# EAGLE design schematic (EAGLE 9.2.2)
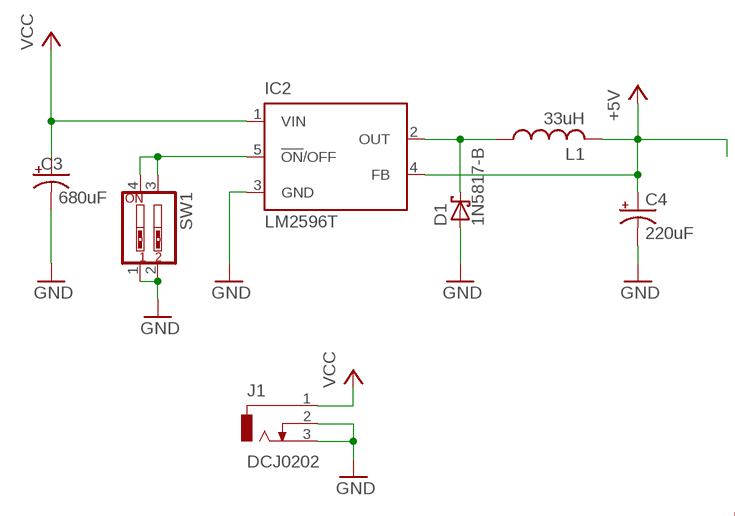
[diagram p0: schematic, sheet 1, part 1 of 2]
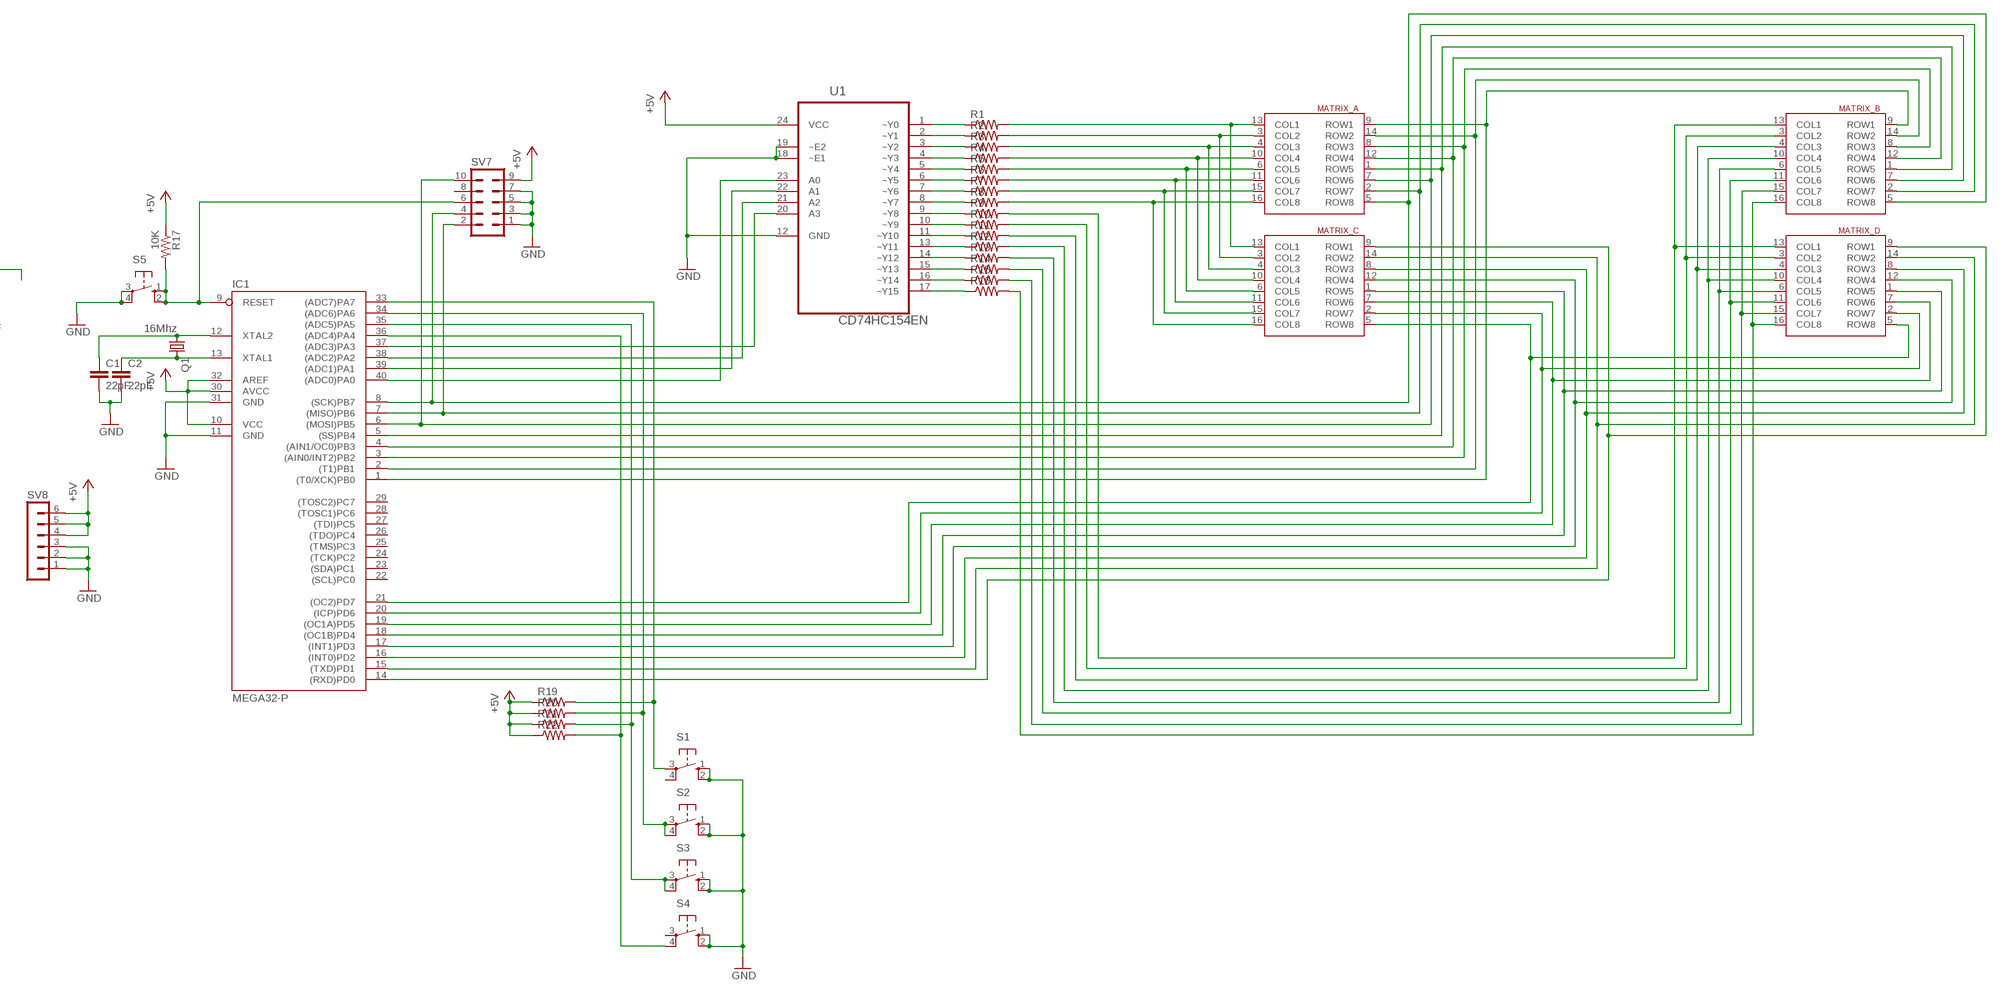
[diagram p1: schematic, sheet 1, part 2 of 2]

## Parts
C1  22pF  C-EU025-024X044  [C025-024X044]
C2  22pF  C-EU025-024X044  [C025-024X044]
C3  680uF  CPOL-USE3.5-8  [E3,5-8]
C4  220uF  CPOL-USE3.5-8  [E3,5-8]
D1  1N5817-B  [DO41-7.6]
IC1  MEGA32-P  [DIL40]
IC2  LM2596T  [T05D]
J1  DCJ0202  [DCJ0202]
L1  33uH  L-US0207/10  [0207/10]
MATRIX_A  LED_8X8_MATRIXYGD2/A  [MATRIX_8X8_38MM]
MATRIX_B  LED_8X8_MATRIXYGD2/A  [MATRIX_8X8_38MM]
MATRIX_C  LED_8X8_MATRIXYGD2/A  [MATRIX_8X8_38MM]
MATRIX_D  LED_8X8_MATRIXYGD2/A  [MATRIX_8X8_38MM]
Q1  16Mhz  CRYSTALHC49S  [HC49/S]
R1  R-US_0204/2V  [0204V]
R2  R-US_0204/2V  [0204V]
R3  R-US_0204/2V  [0204V]
R4  R-US_0204/2V  [0204V]
R5  R-US_0204/2V  [0204V]
R6  R-US_0204/2V  [0204V]
R7  R-US_0204/2V  [0204V]
R8  R-US_0204/2V  [0204V]
R9  R-US_0204/2V  [0204V]
R10  R-US_0204/2V  [0204V]
R11  R-US_0204/2V  [0204V]
R12  R-US_0204/2V  [0204V]
R13  R-US_0204/2V  [0204V]
R14  R-US_0204/2V  [0204V]
R15  R-US_0204/2V  [0204V]
R16  R-US_0204/2V  [0204V]
R17  10K  R-US_0204/7  [0204/7]
R19  R-US_0204/7  [0204/7]
R20  R-US_0204/7  [0204/7]
R21  R-US_0204/7  [0204/7]
R22  R-US_0204/7  [0204/7]
S1  10-XX  [B3F-10XX]
S2  10-XX  [B3F-10XX]
S3  10-XX  [B3F-10XX]
S4  10-XX  [B3F-10XX]
S5  10-XX  [B3F-10XX]
SV7  MA05-2  [MA05-2]
SV8  MA06-1  [MA06-1]
SW1  SW_DIP-2  [EDG-02]
U1  CD74HC154EN  [DIP254P762X508-24]

## Nets
+5V: C4.+ IC1.10(VCC) IC1.30(AVCC) IC1.32(AREF) IC2.4(FB) L1.2 R17.1 R19.1 R20.1 R21.1 R22.1 SV7.9 SV8.4 SV8.5 SV8.6 U1.24(VCC)
GND: C1.2 C2.2 C3.- C4.- D1.A IC1.11(GND) IC1.31(GND) IC2.3(GND) J1.2 J1.3 S1.1(S) S1.2(S1) S2.1(S) S2.2(S1) S3.1(S) S3.2(S1) S4.1(S) S4.2(S1) S5.3(P) S5.4(P1) SV7.1 SV7.3 SV7.5 SV7.7 SV8.1 SV8.2 SV8.3 SW1.1 SW1.2 U1.12(GND) U1.18(~E1) U1.19(~E2)
N$1: R1.1 U1.1(~Y0)
N$2: R2.1 U1.2(~Y1)
N$3: R3.1 U1.3(~Y2)
N$4: R4.1 U1.4(~Y3)
N$5: R5.1 U1.5(~Y4)
N$6: R6.1 U1.6(~Y5)
N$7: R7.1 U1.7(~Y6)
N$8: R8.1 U1.8(~Y7)
N$9: R9.1 U1.9(~Y8)
N$10: R10.1 U1.10(~Y9)
N$11: R11.1 U1.11(~Y10)
N$12: R12.1 U1.13(~Y11)
N$13: R13.1 U1.14(~Y12)
N$14: R14.1 U1.15(~Y13)
N$15: R15.1 U1.16(~Y14)
N$16: R16.1 U1.17(~Y15)
N$17: MATRIX_A.13(COL1) MATRIX_C.13(COL1) R1.2
N$18: MATRIX_A.3(COL2) MATRIX_C.3(COL2) R2.2
N$19: MATRIX_A.4(COL3) MATRIX_C.4(COL3) R3.2
N$20: MATRIX_A.10(COL4) MATRIX_C.10(COL4) R4.2
N$21: MATRIX_A.6(COL5) MATRIX_C.6(COL5) R5.2
N$22: MATRIX_A.11(COL6) MATRIX_C.11(COL6) R6.2
N$23: MATRIX_A.15(COL7) MATRIX_C.15(COL7) R7.2
N$24: MATRIX_A.16(COL8) MATRIX_C.16(COL8) R8.2
N$26: IC1.7((MISO)PB6) MATRIX_A.2(ROW7) MATRIX_B.2(ROW7) SV7.2
N$27: IC1.8((SCK)PB7) MATRIX_A.5(ROW8) MATRIX_B.5(ROW8) SV7.4
N$28: IC1.5((SS)PB4) MATRIX_A.1(ROW5) MATRIX_B.1(ROW5)
N$30: IC1.3((AIN0/INT2)PB2) MATRIX_A.8(ROW3) MATRIX_B.8(ROW3)
N$32: IC1.1((T0/XCK)PB0) MATRIX_A.9(ROW1) MATRIX_B.9(ROW1)
N$34: IC1.15((TXD)PD1) MATRIX_C.14(ROW2) MATRIX_D.14(ROW2)
N$36: IC1.17((INT1)PD3) MATRIX_C.12(ROW4) MATRIX_D.12(ROW4)
N$39: IC1.20((ICP)PD6) MATRIX_C.2(ROW7) MATRIX_D.2(ROW7)
N$41: IC1.9(RESET) R17.2 S5.1(S) S5.2(S1) SV7.6
N$42: MATRIX_B.15(COL7) MATRIX_D.15(COL7) R15.2
N$43: C2.1 IC1.13(XTAL1) Q1.2
N$44: MATRIX_B.6(COL5) MATRIX_D.6(COL5) R13.2
N$45: C1.1 IC1.12(XTAL2) Q1.1
N$46: MATRIX_B.4(COL3) MATRIX_D.4(COL3) R11.2
N$48: MATRIX_B.13(COL1) MATRIX_D.13(COL1) R9.2
N$52: IC1.39((ADC1)PA1) U1.22(A1)
N$54: IC1.37((ADC3)PA3) U1.20(A3)
N$55: IC1.34((ADC6)PA6) R20.2 S2.3(P) S2.4(P1)
N$57: IC1.36((ADC4)PA4) R22.2 S4.4(P1)
N$58: MATRIX_B.3(COL2) MATRIX_D.3(COL2) R10.2
N$59: IC1.2((T1)PB1) MATRIX_A.14(ROW2) MATRIX_B.14(ROW2)
N$60: MATRIX_B.10(COL4) MATRIX_D.10(COL4) R12.2
N$62: MATRIX_B.11(COL6) MATRIX_D.11(COL6) R14.2
N$63: IC1.4((AIN1/OC0)PB3) MATRIX_A.12(ROW4) MATRIX_B.12(ROW4)
N$64: MATRIX_B.16(COL8) MATRIX_D.16(COL8) R16.2
N$66: IC1.6((MOSI)PB5) MATRIX_A.7(ROW6) MATRIX_B.7(ROW6) SV7.10
N$69: IC1.14((RXD)PD0) MATRIX_C.9(ROW1) MATRIX_D.9(ROW1)
N$71: IC1.16((INT0)PD2) MATRIX_C.8(ROW3) MATRIX_D.8(ROW3)
N$73: IC1.18((OC1B)PD4) MATRIX_C.1(ROW5) MATRIX_D.1(ROW5)
N$74: IC1.19((OC1A)PD5) MATRIX_C.7(ROW6) MATRIX_D.7(ROW6)
N$76: IC1.21((OC2)PD7) MATRIX_C.5(ROW8) MATRIX_D.5(ROW8)
N$78: IC1.35((ADC5)PA5) R21.2 S3.3(P) S3.4(P1)
N$80: IC1.33((ADC7)PA7) R19.2 S1.3(P)
N$85: IC1.40((ADC0)PA0) U1.23(A0)
N$87: IC1.38((ADC2)PA2) U1.21(A2)
N$93: D1.C IC2.2(OUT) L1.1
N$94: IC2.5(!ON!/OFF) SW1.3 SW1.4
VCC: C3.+ IC2.1(VIN) J1.1
Unconnected: IC1.22((SCL)PC0) IC1.23((SDA)PC1) IC1.24((TCK)PC2) IC1.25((TMS)PC3) IC1.26((TDO)PC4) IC1.27((TDI)PC5) IC1.28((TOSC1)PC6) IC1.29((TOSC2)PC7) S1.4(P1) S4.3(P) SV7.8

## Library data of the parts
C1 C2 = rcl:C-EU: CAPACITOR, European symbol; SPICEPREFIX: C
C3 C4 = rcl:CPOL-US: POLARIZED CAPACITOR, American symbol; SPICEPREFIX: C
D1 = diode:1N581*: 1.0A SCHOTTKY BARRIER RECTIFIER Source: http://www.diodes.com/datasheets/ds23001.pdf
IC1 = atmel:MEGA32-P: MICROCONTROLLER 32 Kbytes FLASH 2 Kbytes SRAM 1 Kbytes EEPROM USART 8-channel 10 bit ADC Source: www.atmel.com .. doc2503.pdf; MPN: ATMEGA32-16PU; OC_FARNELL: 1661729; OC_NEWARK: 51P1794
IC2 = national-semiconductor:LM2596: SIMPLE SWITCHER® Power Converter 150 kHz 3A Step-Down Voltage Regulator Source: http://www.national.com/ds/LM/LM2596.pdf; MPN: LM2596T-ADJ/LF02; OC_FARNELL: 9494162; OC_NEWARK: 65K5910
J1 = con-jack:DCJ0202: DC POWER JACK Source: DCJ0202.pdf; OC_FARNELL: unknown; OC_NEWARK: unknown
L1 = rcl:L-US: INDUCTOR, American symbol; SPICEPREFIX: L
MATRIX_A MATRIX_B MATRIX_C MATRIX_D = LED:LED_8X8_MATRIX: CPD-15088A YGD2/A Green 8x8 LED matrix
Q1 = crystal:CRYSTAL: CRYSTAL; OC_FARNELL: 1667008; OC_NEWARK: unknown
R1-R16 R19-R22 = rcl:R-US_: RESISTOR, American symbol; SPICEPREFIX: R
R17 = resistor:R-US_: RESISTOR, American symbol
S1-S5 = switch-omron:10-XX: OMRON SWITCH; MPN: B3F-1000; OC_FARNELL: 176432; OC_NEWARK: 36M3542
SV7 = con-lstb:MA05-2: PIN HEADER; OC_FARNELL: unknown; OC_NEWARK: unknown
SV8 = con-lstb:MA06-1: PIN HEADER; OC_FARNELL: unknown; OC_NEWARK: unknown
SW1 = special:SW_DIP-2: DIP SWITCH
U1 = Texas Instruments_By_element14_Batch_1:CD74HC154EN: High-Speed CMOS Logic 4- to 16-Line Decoder/Demultiplexer; MPN: CD74HC154EN; OC_FARNELL: 1287419; OC_NEWARK: 60K5157; PACKAGE: PDIP-24; SUPPLIER: Texas Instruments

## Board
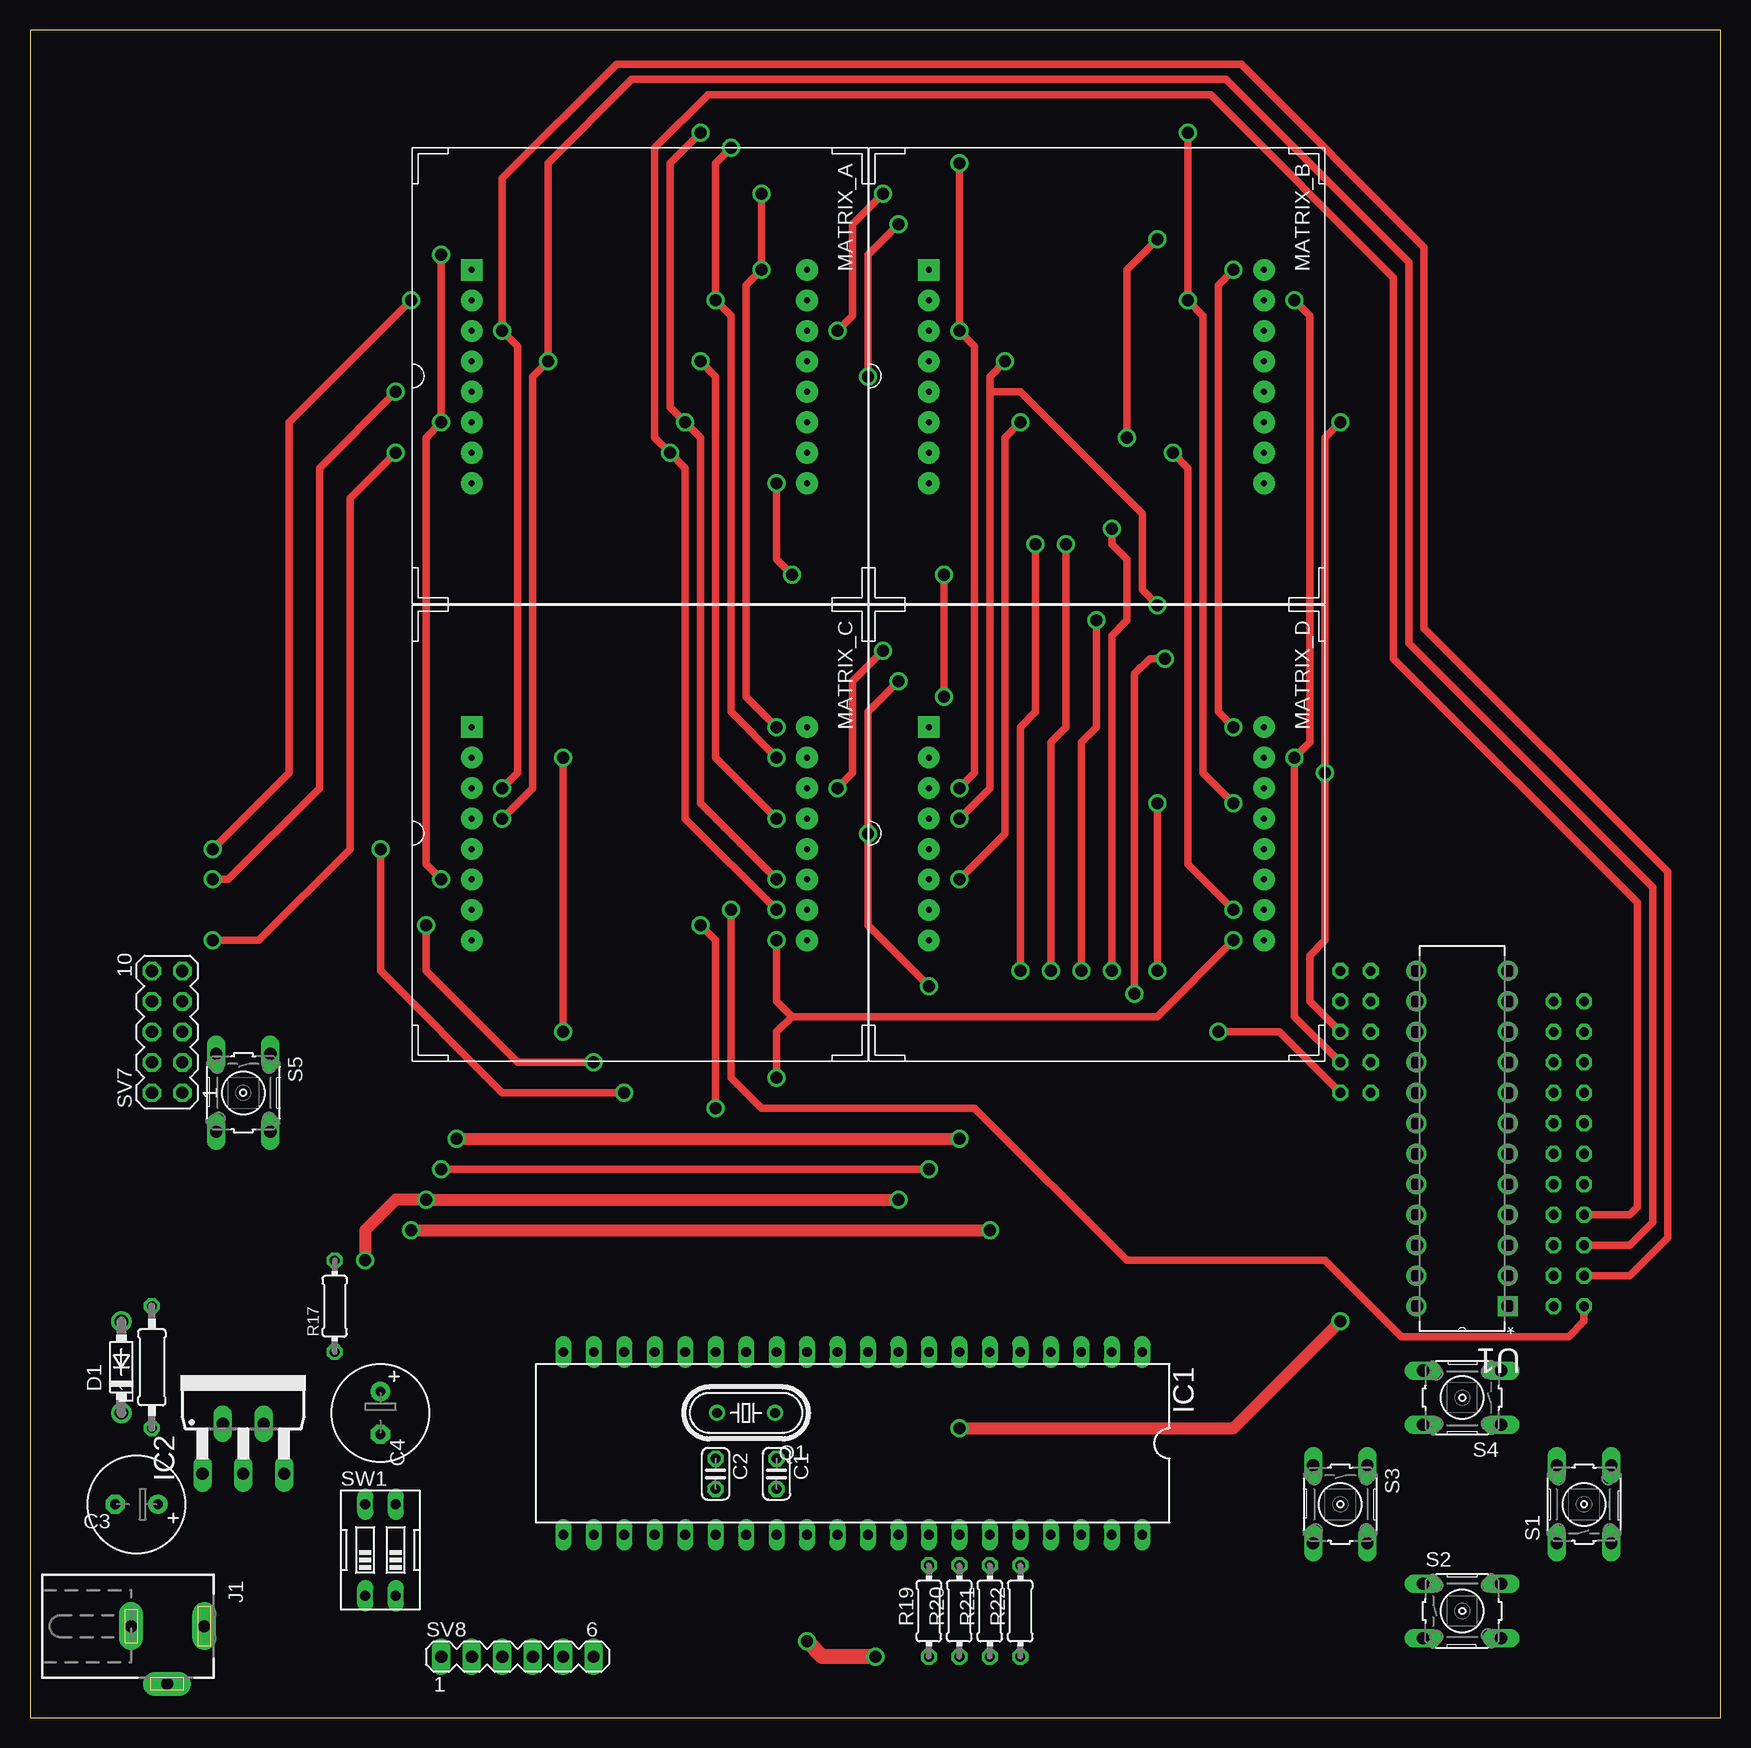
[diagram p2: board, top side]
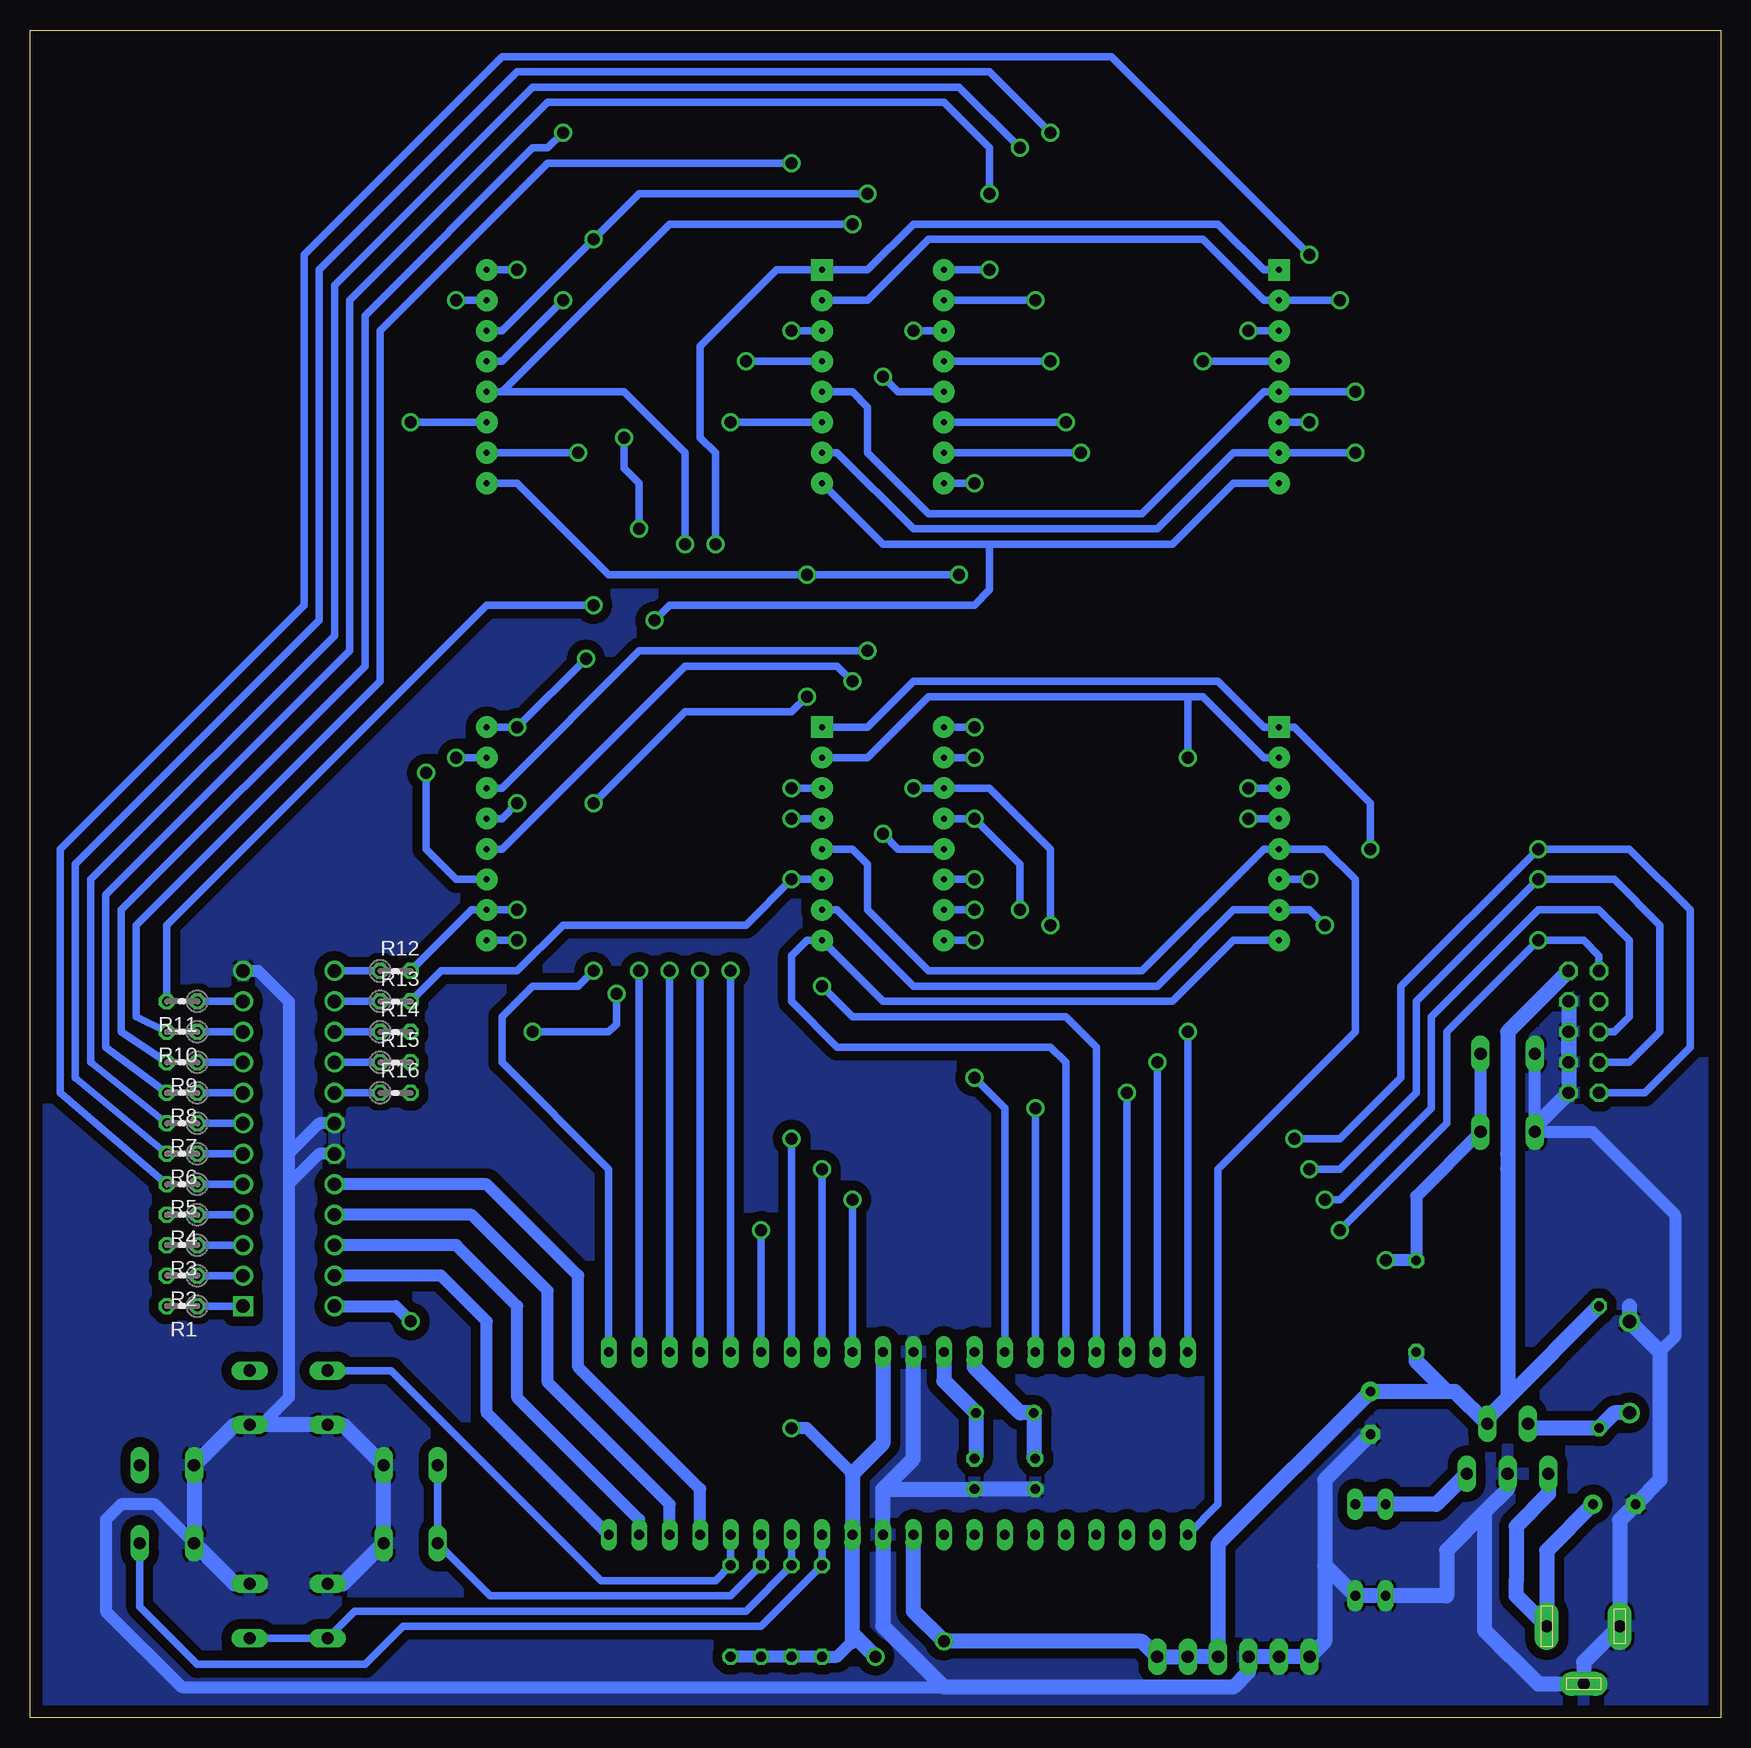
[diagram p3: board, bottom side, seen from below]

Size 140.95 x 140.64 mm. Coordinates in mm from the lower left corner, seen from the top.
Outline: 0,0 140.95,0 140.95,140.64 0,140.64 0,0
Copper layers (1*16): Top 0.035mm / dielectric 1.5mm / Bottom 0.035mm
Design rules "default": minimum track width 6mil, minimum drill 0.35mm, track to track 6mil, track to pad 6mil, pad to pad 6mil, via to via 6mil, smd to smd 6mil, copper to edge 40mil, drill to drill 6mil, minimum pad ring 10mil, minimum via ring 8mil, stop-mask expansion 4mil, vias tented up to drill 0mil, thermal gap 10mil

### Footprints (pad centres in the part's own frame; a part is rotated, then mirrored left to right if it is on the bottom)
C025-024X044 = drill 0.813 octagon: 1 -1.27,0; 2 1.27,0
E3,5-8 = drill 0.813 pad 1.6: + -1.778,0 | drill 0.813 pad 1.6 octagon: - 1.778,0
DO41-7.6 = drill 1.1 pad 1.7: A 3.81,0; C -3.81,0
DIL40 = drill 0.813 long: 1 -24.13,-7.62; 2 -21.59,-7.62; 3 -19.05,-7.62; 4 -16.51,-7.62; 5 -13.97,-7.62; 6 -11.43,-7.62; 7 -8.89,-7.62; 8 -6.35,-7.62; 9 -3.81,-7.62; 10 -1.27,-7.62; 11 1.27,-7.62; 12 3.81,-7.62; 13 6.35,-7.62; 14 8.89,-7.62; 15 11.43,-7.62; 16 13.97,-7.62; 17 16.51,-7.62; 18 19.05,-7.62; 19 21.59,-7.62; 20 24.13,-7.62; 21 24.13,7.62; 22 21.59,7.62; 23 19.05,7.62; 24 16.51,7.62; 25 13.97,7.62; 26 11.43,7.62; 27 8.89,7.62; 28 6.35,7.62; 29 3.81,7.62; 30 1.27,7.62; 31 -1.27,7.62; 32 -3.81,7.62; 33 -6.35,7.62; 34 -8.89,7.62; 35 -11.43,7.62; 36 -13.97,7.62; 37 -16.51,7.62; 38 -19.05,7.62; 39 -21.59,7.62; 40 -24.13,7.62
T05D = drill 1.016 long: 1 -3.404,-5.08; 2 -1.702,-0.914; 3 0,-5.08; 4 1.702,-0.914; 5 3.404,-5.08
DCJ0202 = drill 1 pad 2 long: 1 0,3.1; 2 4.8,0; 3 0,-3
0207/10 = drill 0.813 octagon: 1 -5.08,0; 2 5.08,0
MATRIX_8X8_38MM = drill 0.5 pad 1.8 square: 1 10.16,-33.02 | drill 0.5 pad 1.8: 2 12.7,-33.02; 3 15.24,-33.02; 4 17.78,-33.02; 5 20.32,-33.02; 6 22.86,-33.02; 7 25.4,-33.02; 8 27.94,-33.02; 9 27.94,-5.08; 10 25.4,-5.08; 11 22.86,-5.08; 12 20.32,-5.08; 13 17.78,-5.08; 14 15.24,-5.08; 15 12.7,-5.08; 16 10.16,-5.08
HC49/S = drill 0.813: 1 -2.413,0; 2 2.413,0
0204V = drill 0.813 octagon: 1 -1.27,0; 2 1.27,0
0204/7 = drill 0.813 octagon: 1 -3.81,0; 2 3.81,0
B3F-10XX = drill 1.016 long: 1 -3.251,2.261; 2 3.251,2.261; 3 -3.251,-2.261; 4 3.251,-2.261
MA05-2 = drill 1.016 octagon: 1 -5.08,-1.27; 2 -5.08,1.27; 3 -2.54,-1.27; 4 -2.54,1.27; 5 0,-1.27; 6 0,1.27; 7 2.54,-1.27; 8 2.54,1.27; 9 5.08,-1.27; 10 5.08,1.27
MA06-1 = drill 1.016 long: 1 -6.35,0; 2 -3.81,0; 3 -1.27,0; 4 1.27,0; 5 3.81,0; 6 6.35,0
EDG-02 = drill 0.813 long: 1 -1.27,-3.81; 2 1.27,-3.81; 3 1.27,3.81; 4 -1.27,3.81
DIP254P762X508-24 = drill 1.118 square: 1 -7.62,27.94 | drill 1.118: 2 -7.62,25.4; 3 -7.62,22.86; 4 -7.62,20.32; 5 -7.62,17.78; 6 -7.62,15.24; 7 -7.62,12.7; 8 -7.62,10.16; 9 -7.62,7.62; 10 -7.62,5.08; 11 -7.62,2.54; 12 -7.62,0; 13 0,0; 14 0,2.54; 15 0,5.08; 16 0,7.62; 17 0,10.16; 18 0,12.7; 19 0,15.24; 20 0,17.78; 21 0,20.32; 22 0,22.86; 23 0,25.4; 24 0,27.94

### Placement (x,y rotation side)
C1  62.23,20.32 270 top
C2  57.15,20.32 270 top
C3  8.89,17.78 180 top
C4  29.21,25.4 270 top
D1  7.62,29.21 90 top
IC1  68.58,22.86 180 top
IC2  17.78,25.4 0 top
J1  11.43,7.62 270 top
L1  10.16,29.21 90 top
MATRIX_A  69.85,130.81 270 top
MATRIX_B  107.95,130.81 270 top
MATRIX_C  69.85,92.71 270 top
MATRIX_D  107.95,92.71 270 top
Q1  59.69,25.4 180 top
R1  128.27,34.29 180 bottom
R2  128.27,36.83 180 bottom
R3  128.27,39.37 180 bottom
R4  128.27,41.91 180 bottom
R5  128.27,44.45 180 bottom
R6  128.27,46.99 180 bottom
R7  128.27,49.53 180 bottom
R8  128.27,52.07 180 bottom
R9  128.27,54.61 180 bottom
R10  128.27,57.15 180 bottom
R11  128.27,59.69 180 bottom
R12  110.49,62.23 0 bottom
R13  110.49,59.69 0 bottom
R14  110.49,57.15 0 bottom
R15  110.49,54.61 0 bottom
R16  110.49,52.07 0 bottom
R17  25.4,34.29 90 top
R19  74.93,8.89 90 top
R20  77.47,8.89 90 top
R21  80.01,8.89 90 top
R22  82.55,8.89 90 top
S1  129.54,17.78 90 top
S2  119.38,8.89 0 top
S3  109.22,17.78 270 top
S4  119.38,26.67 180 top
S5  17.78,52.07 270 top
SV7  11.43,57.15 90 top
SV8  40.64,5.08 0 top
SW1  29.21,13.97 0 top
U1  115.57,62.23 180 top

### Tracks (layer width: path | path; a pad name or v marks a point on that pad's centre or on a via)
+5V  (via drill 1)
  Top 1.016: v77.47,24.13 100.33,24.13 v109.22,33.02
  Top 1.27: v64.77,6.35 66.04,5.08 v70.48,5.08
  Bottom 1.016: 72.39,6.35 73.66,5.08 R19.1 R20.1 R21.1 R22.1 | U1.24 110.49,34.29 v109.22,33.02 | 72.39,20.32 76.2,24.13 v77.47,24.13
  Bottom 1.27: 22.86,27.18 22.17,27.18 IC2.4 19.48,24.97 17.78,26.67 | 22.86,27.18 C4.+ 41.91,14.48 SV8.4 SV8.5 SV8.6 48.26,6.35 v64.77,6.35 67.31,8.89 IC1.30 | L1.2 17.78,26.67 | IC1.10 69.85,22.86 72.39,20.32 IC1.32 72.39,6.99 | v70.48,5.08 72.39,6.99 | 72.39,6.35 72.39,6.99 | SV7.9 17.78,57.15 17.78,46.99 17.78,45.72 17.78,26.67 | 22.86,27.18 25.4,29.72 R17.1
GND
  Bottom 1.016: S5.3 S5.4 10.72,48.82 3.81,41.91 3.81,31.75 5.08,30.48 | S1.1 130.53,17.78 133.35,17.78 134.62,16.51 134.62,8.89 128.27,2.54 64.77,2.54 | U1.12 121.92,62.23 119.38,59.69 119.38,46.99 | 119.38,46.99 119.38,44.45 | U1.19 116.84,46.99 119.38,44.45 | 119.38,44.45 119.38,26.67 121.64,24.41 S4.1 | U1.18 116.84,49.53 119.38,46.99
  Bottom 1.27: IC2.3 17.78,19.05 19.69,17.14 | 19.69,17.14 22.86,13.97 22.86,10.16 SW1.1 SW1.2 33.02,12.7 | C4.- 33.02,19.81 33.02,12.7 | 33.02,12.7 33.02,6.35 SV8.1 SV8.3 | 7.62,34.29 D1.A 5.08,30.48 5.08,19.81 C3.- 8.43,16.46 J1.3 11.43,4.62 J1.2 15.24,2.82 19.69,7.27 19.69,17.14 | SV8.3 39.37,3.81 40.64,2.54 64.77,2.54 69.85,7.62 IC1.31 69.85,19.05 | 69.85,19.05 67.31,21.59 IC1.11 | C2.2 C1.2 69.85,19.05 | SV7.7 SV7.5 | SV7.5 SV7.1 15.52,49.25 S5.4 | S4.1 123.9,24.41 S1.2 S1.1 123.9,11.15 S2.2 | S2.1 114.86,11.15 S3.2 S3.1 114.86,24.41 S4.2 121.64,24.41 | SV7.3 SV7.5 | SV8.2 SV8.3
  pour Bottom (isolate 0.813): 0,140.97 0,0 140.97,0 140.97,140.97
N$1
  Bottom 0.61: U1.1 R1.1
N$2
  Bottom 0.61: R2.1 U1.2
N$3
  Bottom 0.61: U1.3 R3.1
N$4
  Bottom 0.61: R4.1 U1.4
N$5
  Bottom 0.61: U1.5 R5.1
N$6
  Bottom 0.61: U1.6 R6.1
N$7
  Bottom 0.61: U1.7 R7.1
N$8
  Bottom 0.61: U1.8 R8.1
N$9
  Bottom 0.61: U1.9 R9.1
N$10
  Bottom 0.61: R10.1 U1.10
N$11
  Bottom 0.61: U1.11 R11.1
N$12
  Bottom 0.61: R12.1 U1.13
N$13
  Bottom 0.61: R13.1 U1.14
N$14
  Bottom 0.61: U1.15 R14.1
N$15
  Bottom 0.61: R15.1 U1.16
N$16
  Bottom 0.61: U1.17 R16.1
N$17  (via drill 1)
  Top 0.61: v62.23,74.93 57.15,80.01 57.15,111.76 v55.88,113.03 | v58.42,67.31 58.42,53.34 60.96,50.8 78.74,50.8 91.44,38.1 107.95,38.1 114.3,31.75 128.27,31.75 129.54,33.02 R1.2
  Bottom 0.61: MATRIX_C.13 v62.23,74.93 58.42,71.12 v58.42,67.31 | v55.88,113.03 MATRIX_A.13
N$18  (via drill 1)
  Top 0.61: v39.37,77.47 40.64,78.74 40.64,114.3 v39.37,115.57 39.37,128.27 48.9,137.79 100.96,137.79 116.2,122.56 116.2,90.81 136.53,70.48 136.53,40 133.35,36.83 R2.2
  Bottom 0.61: MATRIX_C.3 v39.37,77.47 | v39.37,115.57 MATRIX_A.3
N$19  (via drill 1)
  Top 0.61: v39.37,74.93 41.91,77.47 41.91,111.76 v43.18,113.03 43.18,129.54 50.16,136.52 99.69,136.52 114.93,121.29 114.93,89.54 135.25,69.22 135.25,41.27 133.35,39.37 R3.2
  Bottom 0.61: MATRIX_C.4 v39.37,74.93 | v43.18,113.03 MATRIX_A.4
N$20  (via drill 1)
  Top 0.61: v62.23,67.31 54.61,74.93 54.61,104.14 v53.34,105.41 52.07,106.68 52.07,130.81 56.52,135.25 98.42,135.25 113.66,120.02 113.66,88.27 133.99,67.95 133.99,42.54 133.35,41.91 R4.2
  Bottom 0.61: MATRIX_C.10 v62.23,67.31 | v53.34,105.41 MATRIX_A.10
N$21  (via drill 1)
  Top 0.61: v34.29,69.85 33.02,71.12 33.02,106.68 v34.29,107.95 v34.29,121.92
  Bottom 0.61: MATRIX_C.6 v34.29,69.85 | v34.29,107.95 MATRIX_A.6 | R5.2 138.43,52.07 138.43,72.39 118.11,92.71 118.11,121.92 101.6,138.43 50.8,138.43 v34.29,121.92
N$22  (via drill 1)
  Top 0.61: v62.23,69.85 55.88,76.2 55.88,106.68 v54.61,107.95 53.34,109.22 53.34,129.54 v55.88,132.08
  Bottom 0.61: MATRIX_C.11 v62.23,69.85 | v54.61,107.95 MATRIX_A.11 | R6.2 137.16,53.34 137.16,71.12 116.84,91.44 116.84,120.65 100.33,137.16 60.96,137.16 v55.88,132.08
N$23  (via drill 1)
  Top 0.61: v62.23,80.01 58.42,83.82 58.42,116.84 v57.15,118.11 57.15,129.54 v58.42,130.81
  Bottom 0.61: MATRIX_C.15 v62.23,80.01 | v57.15,118.11 MATRIX_A.15 | R7.2 135.89,54.61 135.89,69.85 115.57,90.17 115.57,119.38 99.06,135.89 63.5,135.89 v58.42,130.81
N$24  (via drill 1)
  Top 0.61: v62.23,82.55 59.69,85.09 59.69,119.38 v60.96,120.65 v60.96,127
  Bottom 0.61: MATRIX_C.16 v62.23,82.55 | v60.96,120.65 MATRIX_A.16 | R8.2 134.62,55.88 134.62,68.58 114.3,88.9 114.3,118.11 97.79,134.62 64.77,134.62 60.96,130.81 v60.96,127
N$26  (via drill 1)
  Top 0.61: v15.24,72.39 21.59,78.74 21.59,107.95 v31.75,118.11
  Top 1.016: v35.56,48.26 v77.47,48.26
  Bottom 0.61: MATRIX_B.2 71.12,118.11 66.04,123.19 43.18,123.19 38.1,118.11 MATRIX_A.2 v31.75,118.11 | v77.47,48.26 IC1.7 | SV7.2 6.35,52.07 2.54,55.88 2.54,67.31 7.62,72.39 v15.24,72.39 26.67,60.96 26.67,53.34 31.75,48.26 v35.56,48.26
N$27  (via drill 1)
  Top 0.61: v15.24,69.85 16.51,69.85 24.13,77.47 24.13,104.14 v30.48,110.49 | v34.29,45.72 v74.93,45.72
  Bottom 0.61: SV7.4 7.62,54.61 5.08,57.15 5.08,66.04 8.89,69.85 v15.24,69.85 25.4,59.69 25.4,52.07 31.75,45.72 v34.29,45.72 | v30.48,110.49 MATRIX_A.5 38.1,110.49 48.26,100.33 66.04,100.33 71.12,105.41 71.12,109.22 72.39,110.49 MATRIX_B.5 | v74.93,45.72 IC1.8
N$28  (via drill 1)
  Top 0.61: v83.82,97.79 83.82,83.82 82.55,82.55 v82.55,62.23
  Bottom 0.61: MATRIX_A.1 38.1,120.65 41.91,124.46 67.31,124.46 71.12,120.65 MATRIX_B.1 78.74,120.65 85.09,114.3 85.09,106.68 83.82,105.41 v83.82,97.79 | IC1.5 v82.55,62.23
N$30  (via drill 1)
  Top 0.61: v87.63,62.23 87.63,81.28 88.9,82.55 v88.9,91.44
  Bottom 0.61: MATRIX_A.8 40.64,102.87 45.72,97.79 60.96,97.79 | MATRIX_B.8 69.85,97.79 60.96,97.79 | IC1.3 v87.63,62.23 | 60.96,97.79 60.96,93.98 62.23,92.71 87.63,92.71 v88.9,91.44
N$32  (via drill 1)
  Top 0.61: v62.23,102.87 62.23,96.52 v63.5,95.25 | v93.98,62.23 v93.98,76.2 | v76.2,85.09 v76.2,95.25
  Bottom 0.61: MATRIX_B.9 100.33,102.87 92.71,95.25 v76.2,95.25 v63.5,95.25 | v62.23,102.87 MATRIX_A.9 | IC1.1 92.71,45.72 101.6,54.61 101.6,58.42 99.06,60.96 95.25,60.96 v93.98,62.23 | v93.98,76.2 86.36,83.82 77.47,83.82 v76.2,85.09
N$34  (via drill 1)
  Top 0.61: v67.31,77.47 68.58,78.74 68.58,86.36 v71.12,88.9 | v57.15,50.8 57.15,64.77 v55.88,66.04
  Bottom 0.61: v71.12,88.9 90.17,88.9 101.6,77.47 MATRIX_D.14 | v67.31,77.47 MATRIX_C.14 60.96,77.47 55.88,72.39 v55.88,66.04 | IC1.15 v57.15,50.8
N$36  (via drill 1)
  Top 0.61: v72.39,86.36 69.85,83.82 v69.85,73.66 69.85,66.04 v74.93,60.96
  Bottom 0.61: MATRIX_C.12 68.58,72.39 v69.85,73.66 | v72.39,86.36 73.66,87.63 86.36,87.63 101.6,72.39 MATRIX_D.12 | IC1.17 52.07,55.88 54.61,58.42 72.39,58.42 v74.93,60.96
N$39  (via drill 1)
  Top 0.61: v44.45,57.15 v44.45,80.01
  Bottom 0.61: MATRIX_C.2 38.1,80.01 43.18,85.09 44.45,85.09 | 44.45,85.09 66.04,85.09 71.12,80.01 MATRIX_D.2 | IC1.20 v44.45,57.15 | v44.45,80.01 44.45,85.09
N$41  (via drill 1)
  Top 1.016: v27.94,38.1 27.94,40.64 30.48,43.18 v33.02,43.18 v72.39,43.18
  Bottom 0.61: v72.39,43.18 72.39,40.64 IC1.9 | SV7.6 8.89,57.15 7.62,58.42 7.62,64.77 10.16,67.31 15.24,67.31 | 15.24,67.31 24.13,58.42 24.13,50.8 31.75,43.18 v33.02,43.18 | 15.24,67.31
  Bottom 1.016: S5.1 S5.2 25.4,43.46 R17.2 v27.94,38.1
N$42  (via drill 1)
  Top 0.61: v105.41,118.11 106.68,116.84 106.68,81.28 v105.41,80.01 105.41,58.42 R15.2
  Bottom 0.61: MATRIX_D.15 v105.41,80.01 | v105.41,118.11 MATRIX_B.15
N$43
  Bottom 1.27: C2.1 57.28,21.72 Q1.2 58.42,25.4 62.23,29.21 IC1.13
N$44  (via drill 1)
  Top 0.61: v77.47,69.85 81.28,73.66 81.28,106.68 v82.55,107.95
  Bottom 0.61: MATRIX_D.6 v77.47,69.85 81.28,66.04 96.52,66.04 100.33,62.23 106.68,62.23 R13.2 | v82.55,107.95 MATRIX_B.6
N$45
  Bottom 1.27: IC1.12 64.77,28.07 Q1.1 62.1,21.72 C1.1
N$46  (via drill 1)
  Top 0.61: v77.47,74.93 80.01,77.47 80.01,110.49 | 80.01,110.49 80.01,111.76 v81.28,113.03 | v93.98,92.71 92.71,93.98 92.71,100.33 82.55,110.49 80.01,110.49
  Bottom 0.61: v81.28,113.03 MATRIX_B.4 | MATRIX_D.4 v77.47,74.93 | v93.98,92.71 102.87,92.71 129.54,66.04 R11.2
N$48  (via drill 1)
  Top 0.61: v100.33,76.2 97.79,78.74 97.79,116.84 v96.52,118.11 v96.52,132.08
  Bottom 0.61: MATRIX_D.13 101.6,74.93 v100.33,76.2 | v96.52,118.11 101.6,113.03 MATRIX_B.13 | R9.2 133.35,57.15 133.35,67.31 113.03,87.63 113.03,116.84 99.06,130.81 97.79,130.81 v96.52,132.08
N$52
  Bottom 1.016: IC1.39 90.17,16.51 100.33,26.67 100.33,34.29 105.41,39.37 U1.22
N$54
  Bottom 1.016: IC1.37 85.09,19.05 95.25,29.21 95.25,36.83 102.87,44.45 U1.20
N$55
  Bottom 0.61: IC1.34 R20.2 81.28,8.89 113.87,8.89 S2.3 S2.4
N$57
  Bottom 0.61: IC1.36 R22.2 83.82,11.43 93.34,11.43 110.85,28.93 S4.4
N$58  (via drill 1)
  Top 0.61: v77.47,77.47 78.74,78.74 78.74,114.3 v77.47,115.57 v77.47,129.54
  Bottom 0.61: 76.2,77.47 MATRIX_D.3 v77.47,77.47 | v77.47,115.57 MATRIX_B.3 | R10.2 132.08,58.42 132.08,66.04 111.76,86.36 111.76,115.57 97.79,129.54 v77.47,129.54
N$59  (via drill 1)
  Top 0.61: v71.12,127 68.58,124.46 68.58,116.84 v67.31,115.57 | v91.44,106.68 91.44,120.65 v93.98,123.19 | v90.17,62.23 90.17,90.17 91.44,91.44 91.44,96.52 90.17,97.79 v90.17,99.06
  Bottom 0.61: MATRIX_B.14 101.6,115.57 v93.98,123.19 90.17,127 v71.12,127 | v67.31,115.57 MATRIX_A.14 | v91.44,106.68 91.44,104.14 90.17,102.87 v90.17,99.06 | IC1.2 v90.17,62.23
N$60  (via drill 1)
  Top 0.61: v100.33,67.31 96.52,71.12 96.52,104.14 v95.25,105.41
  Bottom 0.61: v100.33,67.31 MATRIX_D.10 104.14,67.31 R12.2 | v95.25,105.41 MATRIX_B.10
N$62  (via drill 1)
  Top 0.61: v109.22,107.95 107.95,106.68 v107.95,78.74 107.95,64.77 106.68,63.5 106.68,59.69 R14.2
  Bottom 0.61: MATRIX_D.11 105.41,69.85 107.95,72.39 v107.95,78.74 | v109.22,107.95 MATRIX_B.11
N$63  (via drill 1)
  Top 0.61: v72.39,124.46 69.85,121.92 v69.85,111.76 | v86.36,97.79 86.36,82.55 85.09,81.28 v85.09,62.23
  Bottom 0.61: MATRIX_B.12 101.6,110.49 | 101.6,110.49 87.63,124.46 v72.39,124.46 | v69.85,111.76 68.58,110.49 MATRIX_A.12 | v86.36,97.79 86.36,105.41 91.44,110.49 101.6,110.49 | IC1.4 v85.09,62.23
N$64  (via drill 1)
  Top 0.61: v100.33,82.55 99.06,83.82 99.06,119.38 v100.33,120.65 | R16.2 104.14,57.15 v99.06,57.15 | v92.07,60.32 92.07,87 93.34,88.27 v94.61,88.27
  Bottom 0.61: MATRIX_D.16 v100.33,82.55 v94.61,88.27 | v100.33,120.65 MATRIX_B.16 | v99.06,57.15 92.71,57.15 92.07,57.78 v92.07,60.32
N$66  (via drill 1)
  Top 0.61: v15.24,64.77 19.05,64.77 26.67,72.39 26.67,101.6 v30.48,105.41
  Top 1.016: v31.75,40.64 v80.01,40.64
  Bottom 0.61: MATRIX_B.7 73.66,105.41 67.31,99.06 46.99,99.06 40.64,105.41 MATRIX_A.7 v30.48,105.41 | IC1.6 v80.01,40.64 | SV7.10 10.16,63.5 11.43,64.77 v15.24,64.77 22.86,57.15 22.86,49.53 v31.75,40.64
N$69  (via drill 1)
  Top 0.61: v62.23,64.77 62.23,59.69 63.5,58.42 | 63.5,58.42 93.98,58.42 v100.33,64.77 | v62.23,53.34 62.23,57.15 63.5,58.42
  Bottom 0.61: MATRIX_C.9 v62.23,64.77 | v100.33,64.77 MATRIX_D.9 | IC1.14 59.69,50.8 v62.23,53.34
N$71
  Bottom 0.61: MATRIX_C.8 40.64,64.77 45.72,59.69 69.85,59.69 MATRIX_D.8 76.2,64.77 77.47,63.5 77.47,59.69 73.66,55.88 55.88,55.88 54.61,54.61 IC1.16
N$73  (via drill 1)
  Top 0.61: v49.53,52.07 39.37,52.07 29.21,62.23 v29.21,72.39
  Bottom 0.61: MATRIX_D.1 71.12,82.55 67.31,86.36 41.91,86.36 38.1,82.55 MATRIX_C.1 35.56,82.55 29.21,76.2 v29.21,72.39 | IC1.18 v49.53,52.07
N$74  (via drill 1)
  Top 0.61: v46.99,54.61 40.64,54.61 33.02,62.23 v33.02,66.04
  Bottom 0.61: MATRIX_D.7 73.66,67.31 67.31,60.96 46.99,60.96 40.64,67.31 MATRIX_C.7 34.29,67.31 v33.02,66.04 | IC1.19 v46.99,54.61
N$76
  Bottom 0.61: MATRIX_D.5 72.39,72.39 71.12,71.12 71.12,67.31 66.04,62.23 48.26,62.23 38.1,72.39 MATRIX_C.5 33.02,72.39 30.48,69.85 30.48,57.15 41.91,45.72 41.91,17.78 IC1.21
N$78
  Bottom 0.61: IC1.35 R21.2 82.55,10.16 102.59,10.16 S3.4 S3.3
N$80
  Bottom 0.61: IC1.33 R19.2 80.01,7.62 109.85,7.62 113.03,4.45 127,4.45 131.8,9.25 S1.3
N$85
  Bottom 1.016: IC1.40 102.87,25.4 102.87,33.02 106.68,36.83 U1.23
N$87
  Bottom 1.016: IC1.38 87.63,17.78 97.79,27.94 97.79,35.56 104.14,41.91 U1.21
N$93
  Bottom 1.27: D1.C 8.89,25.4 L1.1 15.72,24.13 IC2.2
N$94
  Bottom 1.27: IC2.5 23.72,17.78 SW1.4 SW1.3
VCC
  Bottom 1.27: IC2.1 14.38,18.64 17.07,15.95 17.07,11.43 | C3.+ 14.53,13.92 J1.1 17.07,10.16 17.07,11.43 | 17.02,11.43 17.07,11.43